# Altium schematic sheet OutputSockets.SchDoc
size A4; SheetNumber: 9; SheetTotal: 10
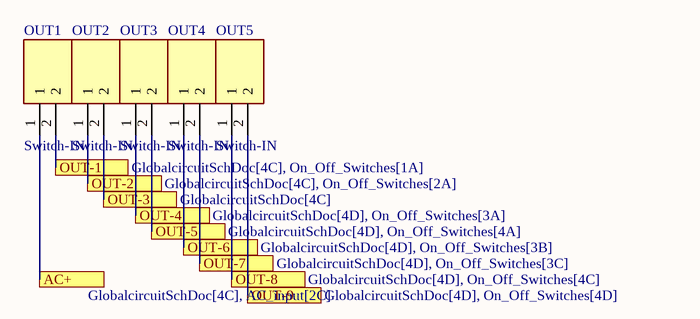
[diagram p0: OutputSockets.SchDoc]

## Parts
OUT1  Switch-IN  [TE_796949-2]
OUT2  Switch-IN  [TE_796949-2]
OUT3  Switch-IN  [TE_796949-2]
OUT4  Switch-IN  [TE_796949-2]
OUT5  Switch-IN  [TE_796949-2]

## Ports
AC+ (see GlobalcircuitSchDoc[4C], AC_input[2C]), OUT-1 (see GlobalcircuitSchDoc[4C], On_Off_Switches[1A]), OUT-2 (see GlobalcircuitSchDoc[4C], On_Off_Switches[2A]), OUT-3 (see GlobalcircuitSchDoc[4C]), OUT-4 (see GlobalcircuitSchDoc[4D], On_Off_Switches[3A]), OUT-5 (see GlobalcircuitSchDoc[4D], On_Off_Switches[4A]), OUT-6 (see GlobalcircuitSchDoc[4D], On_Off_Switches[3B]), OUT-7 (see GlobalcircuitSchDoc[4D], On_Off_Switches[3C]), OUT-8 (see GlobalcircuitSchDoc[4D], On_Off_Switches[4C]), OUT-9 (see GlobalcircuitSchDoc[4D], On_Off_Switches[4D])

## Nets
AC+: OUT1.1 ; port AC+
OUT-1: OUT1.2 ; port OUT-1
OUT-2: OUT2.1 ; port OUT-2
OUT-3: OUT2.2 ; port OUT-3
OUT-4: OUT3.1 ; port OUT-4
OUT-5: OUT3.2 ; port OUT-5
OUT-6: OUT4.1 ; port OUT-6
OUT-7: OUT4.2 ; port OUT-7
OUT-8: OUT5.1 ; port OUT-8
OUT-9: OUT5.2 ; port OUT-9

## Library data of the parts
OUT1-OUT5 = 796949-2: Connector Terminal Blocks 2 Position 5.08mm Solder Straight Thru-Hole 17.5A/Contact; MF: TE Connectivity; EU_RoHS_Compliance: Compliant with Exemptions; Price: None; Availability: Unavailable; TE_purchase_URL: https://www.te.com/usa-en/product-796949-2.html?te_bu=Cor&te_type=disp&te_campaign=seda_glo_cor-seda-global-disp-prtnr-fy19-seda-model-bom-cta_sma-317_1&elqCampaignId=32493; Package: None; SnapEDA_Link: https://www.snapeda.com/parts/796949-2/TE%20Connectivity%20AMP%20Connectors/view-part/492230/?ref=snap; MP: 796949-2; Value: *